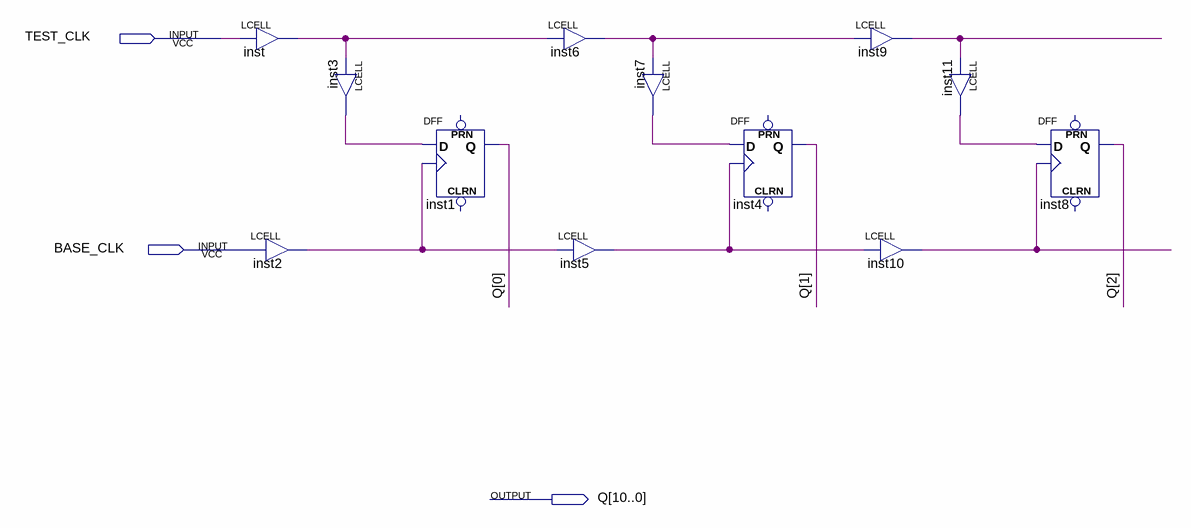
[diagram p0: schematic sheet]
// Quartus schematic DelayLine.bdf as structural Verilog: 12 symbols, 3 pins
module DelayLine (
  input  TEST_CLK,
  input  BASE_CLK,
  output [10:0] Q
);

  wire inst2_out, inst3_out, inst5_out, inst6_out, inst7_out, inst9_out, inst10_out, inst11_out, inst_out;

  LCELL inst (.IN(TEST_CLK), .OUT(inst_out));
  LCELL inst2 (.IN(BASE_CLK), .OUT(inst2_out));
  LCELL inst3 (.IN(inst_out), .OUT(inst3_out));
  DFF inst1 (.CLK(inst2_out), .D(inst3_out), .Q(Q[0]));  // open: CLRN, PRN
  LCELL inst6 (.IN(inst_out), .OUT(inst6_out));
  LCELL inst5 (.IN(inst2_out), .OUT(inst5_out));
  LCELL inst7 (.IN(inst6_out), .OUT(inst7_out));
  DFF inst4 (.CLK(inst5_out), .D(inst7_out), .Q(Q[1]));  // open: CLRN, PRN
  LCELL inst9 (.IN(inst6_out), .OUT(inst9_out));
  LCELL inst10 (.IN(inst5_out), .OUT(inst10_out));
  LCELL inst11 (.IN(inst9_out), .OUT(inst11_out));
  DFF inst8 (.CLK(inst10_out), .D(inst11_out), .Q(Q[2]));  // open: CLRN, PRN
endmodule
